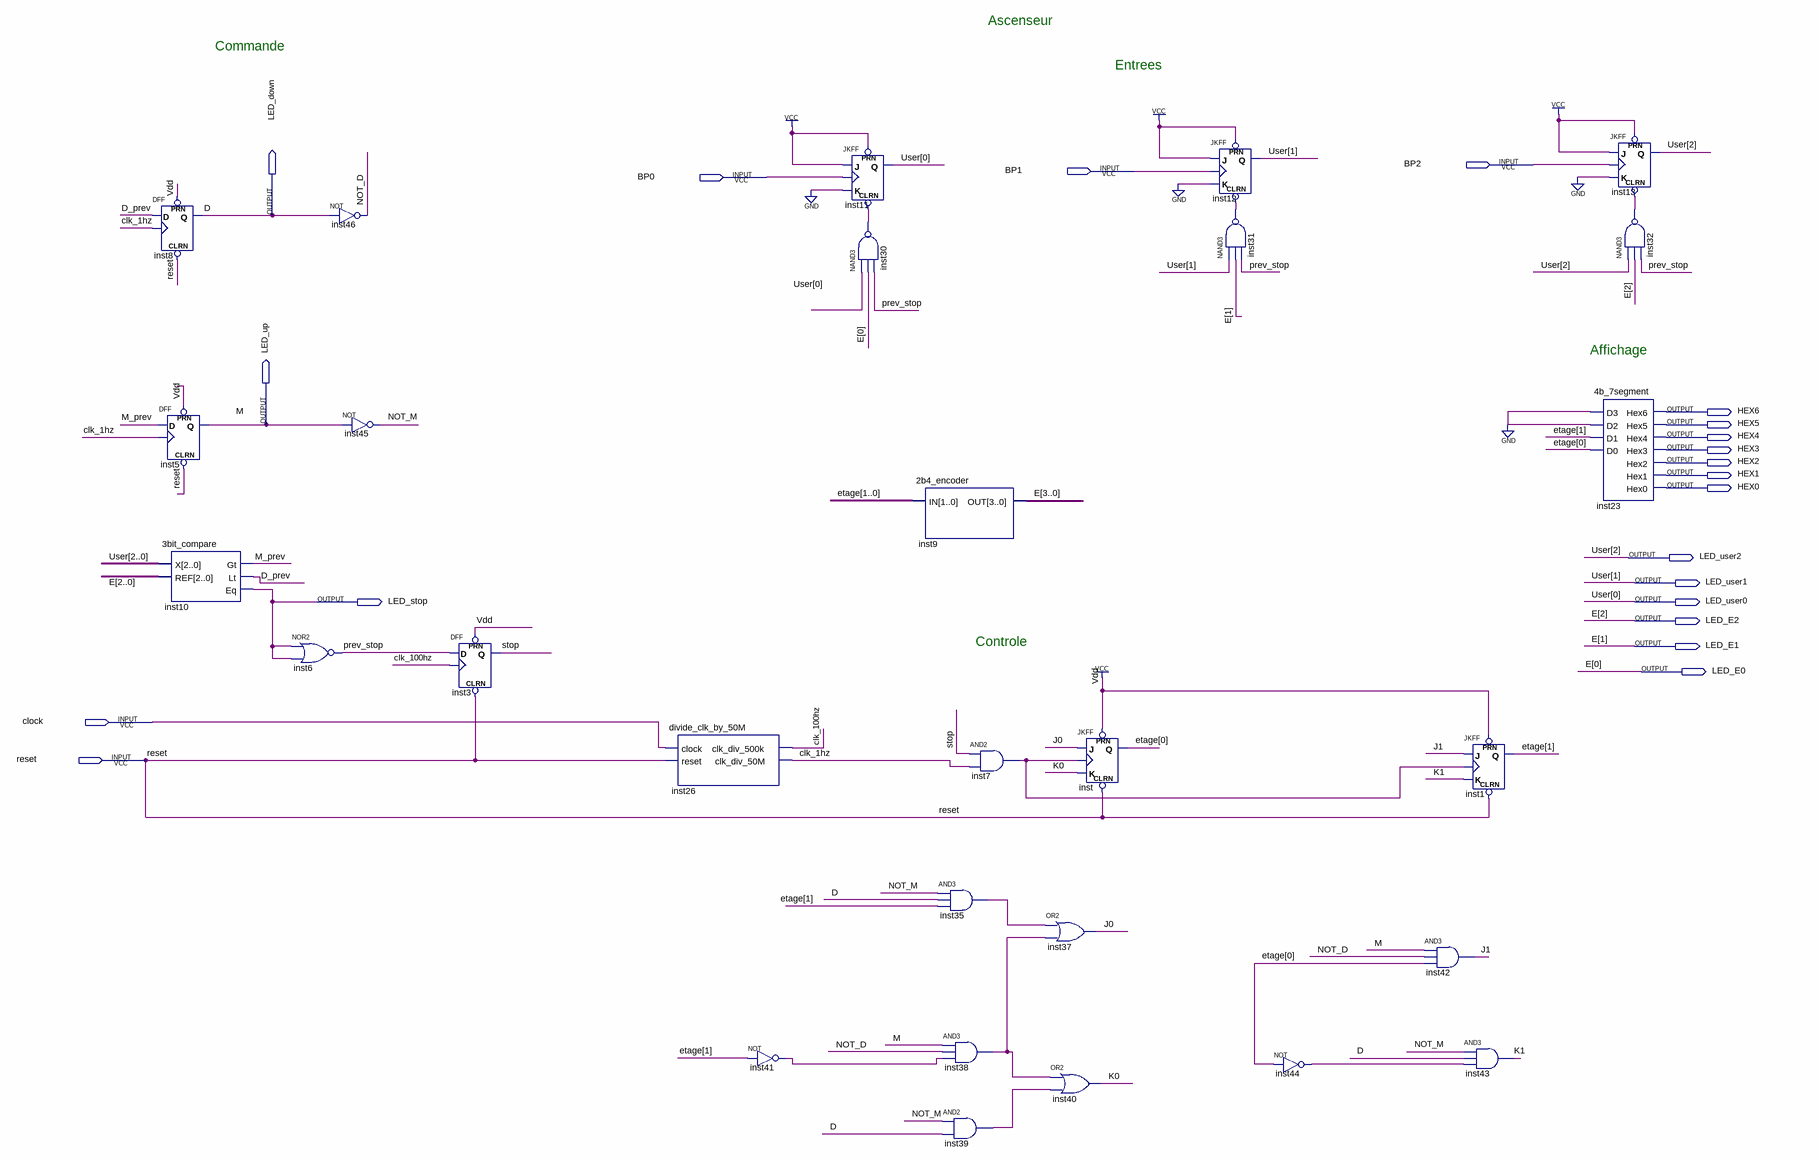
[diagram p0: schematic sheet]
// Quartus schematic Ascenseur.bdf as structural Verilog: 28 symbols, 21 pins
module Ascenseur (
  input  BP2,
  input  BP1,
  input  BP0,
  input  clock,
  input  reset,
  output LED_down,
  output HEX6,
  output LED_up,
  output HEX5,
  output HEX4,
  output HEX3,
  output HEX2,
  output HEX1,
  output HEX0,
  output LED_user2,
  output LED_user1,
  output LED_stop,
  output LED_user0,
  output LED_E2,
  output LED_E1,
  output LED_E0
);

  wire clk_1hz, clk_100hz, D_prev, inst7_out, inst30_out, inst31_out, inst32_out, inst35_out, inst38_out,
       inst39_out, inst41_out, inst44_out, J0, J1, K0, K1, M_prev, NOT_D, NOT_M, prev_stop, stop;
  wire [1:0] etage;
  wire [3:3] E;

  DFF inst8 (.CLRN(reset), .CLK(clk_1hz), .D(D_prev), .PRN(1'b1), .Q(LED_down));
  DFF inst5 (.CLRN(reset), .CLK(clk_1hz), .D(M_prev), .PRN(1'b1), .Q(LED_up));
  \3bit_compare  inst10 (
    .X({LED_user2, LED_user1, LED_user0}), .REF({LED_E2, LED_E1, LED_E0}), .Gt(M_prev), .Lt(D_prev),
    .Eq(LED_stop));
  nor inst6 (prev_stop, LED_stop, LED_stop);
  not inst46 (NOT_D, LED_down);
  not inst45 (NOT_M, LED_up);
  DFF inst3 (.CLRN(reset), .CLK(clk_100hz), .D(prev_stop), .PRN(1'b1), .Q(stop));
  divide_clk_by_50M inst26 (.clock(clock), .reset(reset), .clk_div_500k(clk_100hz), .clk_div_50M(clk_1hz));
  not inst41 (inst41_out, etage[1]);
  JKFF inst11 (.PRN(1'b1), .CLRN(inst30_out), .K(1'b0), .J(1'b1), .CLK(BP0), .Q(LED_user0));
  nand inst30 (inst30_out, LED_user0, LED_E0, prev_stop);
  \2b4_encoder  inst9 (.IN(etage), .OUT({E[3], LED_E2, LED_E1, LED_E0}));
  and inst35 (inst35_out, NOT_M, LED_down, etage[1]);
  and inst38 (inst38_out, LED_up, NOT_D, inst41_out);
  and inst39 (inst39_out, NOT_M, LED_down);
  and inst7 (inst7_out, stop, clk_1hz);
  or inst37 (J0, inst35_out, inst38_out);
  or inst40 (K0, inst38_out, inst39_out);
  JKFF inst (.PRN(1'b1), .CLRN(reset), .K(K0), .J(J0), .CLK(inst7_out), .Q(etage[0]));
  JKFF inst12 (.PRN(1'b1), .CLRN(inst31_out), .K(1'b0), .J(1'b1), .CLK(BP1), .Q(LED_user1));
  nand inst31 (inst31_out, LED_user1, LED_E1, prev_stop);
  not inst44 (inst44_out, etage[0]);
  and inst42 (J1, LED_up, NOT_D, etage[0]);
  JKFF inst1 (.PRN(1'b1), .CLRN(reset), .K(K1), .J(J1), .CLK(inst7_out), .Q(etage[1]));
  and inst43 (K1, NOT_M, LED_down, inst44_out);
  JKFF inst13 (.PRN(1'b1), .CLRN(inst32_out), .K(1'b0), .J(1'b1), .CLK(BP2), .Q(LED_user2));
  \4b_7segment  inst23 (
    .D3(1'b0), .D2(1'b0), .D1(etage[1]), .D0(etage[0]), .Hex6(HEX6), .Hex5(HEX5), .Hex4(HEX4), .Hex3(HEX3),
    .Hex2(HEX2), .Hex1(HEX1), .Hex0(HEX0));
  nand inst32 (inst32_out, LED_user2, LED_E2, prev_stop);

  // Other names for the same wires on the sheet: D = LED_down; E[2:0] = {LED_E2, LED_E1, LED_E0}; M = LED_up;
  //   User[2:0] = {LED_user2, LED_user1, LED_user0}

  // Notes on the sheet:
  //   Ascenseur
  //   Commande
  //   Entrees
  //   Affichage
  //   Controle
endmodule
